# Altium project Smart_Reclyce_Bin.PrjPcb
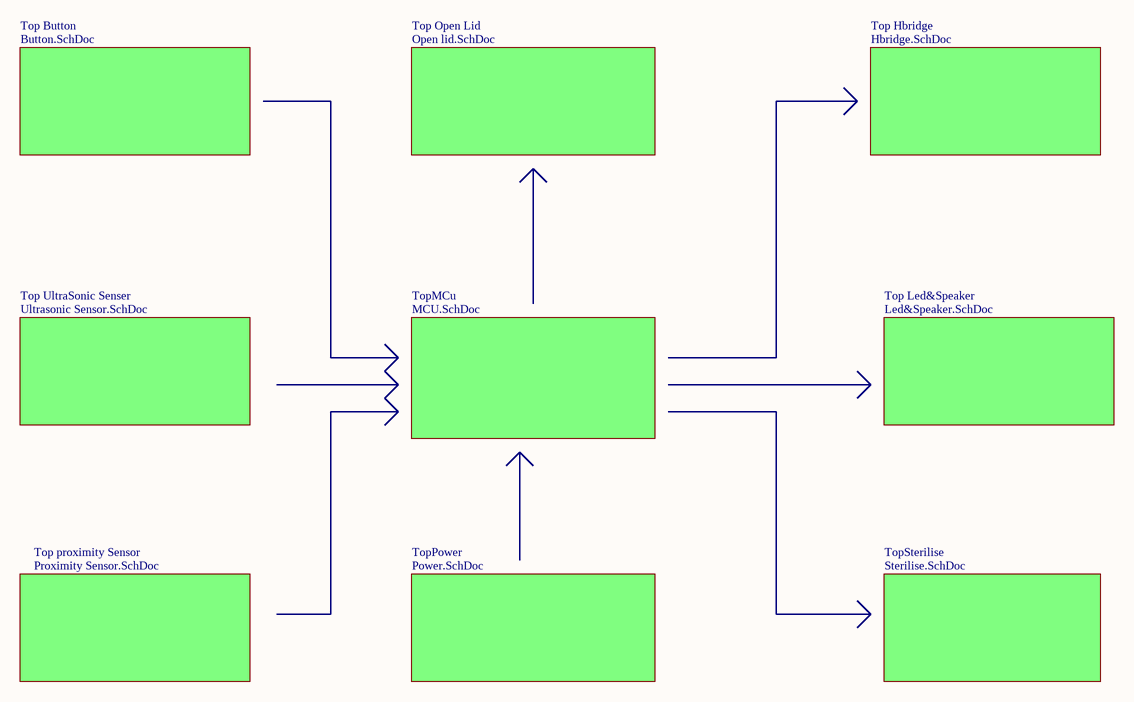
[diagram p0: Smart_Reclyce_Bin.SchDoc]
9 sheets, 233 parts. Net scope: global (net labels, ports and power ports of the same name join across sheets).
Board files: Smart_Reclyce_Bin.PcbDoc, Hbridge.PcbDoc, Open lid.PcbDoc, Proximity Sensor.PcbDoc, Sterilise.PcbDoc, Button.PcbDoc
Sheets:
  Smart_Reclyce_Bin.SchDoc
    TopMCu = MCU.SchDoc
    Top Hbridge = Hbridge.SchDoc
    Top proximity Sensor = Proximity Sensor.SchDoc
    Top Button = Button.SchDoc
    Top Open Lid = Open lid.SchDoc
    Top UltraSonic Senser = Ultrasonic Sensor.SchDoc
    TopSterilise = Sterilise.SchDoc
    Top Led&Speaker = Led&Speaker.SchDoc

## Sheet Smart_Reclyce_Bin.SchDoc
size A4

### Sub-sheets
Top Button = Button.SchDoc: no entries
Top Hbridge = Hbridge.SchDoc: no entries
Top Led&Speaker = Led&Speaker.SchDoc: no entries
Top Open Lid = Open lid.SchDoc: no entries
Top proximity Sensor = Proximity Sensor.SchDoc: no entries
Top UltraSonic Senser = Ultrasonic Sensor.SchDoc: no entries
TopMCu = MCU.SchDoc: no entries
TopPower = Power.SchDoc (file not in this document): no entries
TopSterilise = Sterilise.SchDoc: no entries

## Sheet MCU.SchDoc
size A2
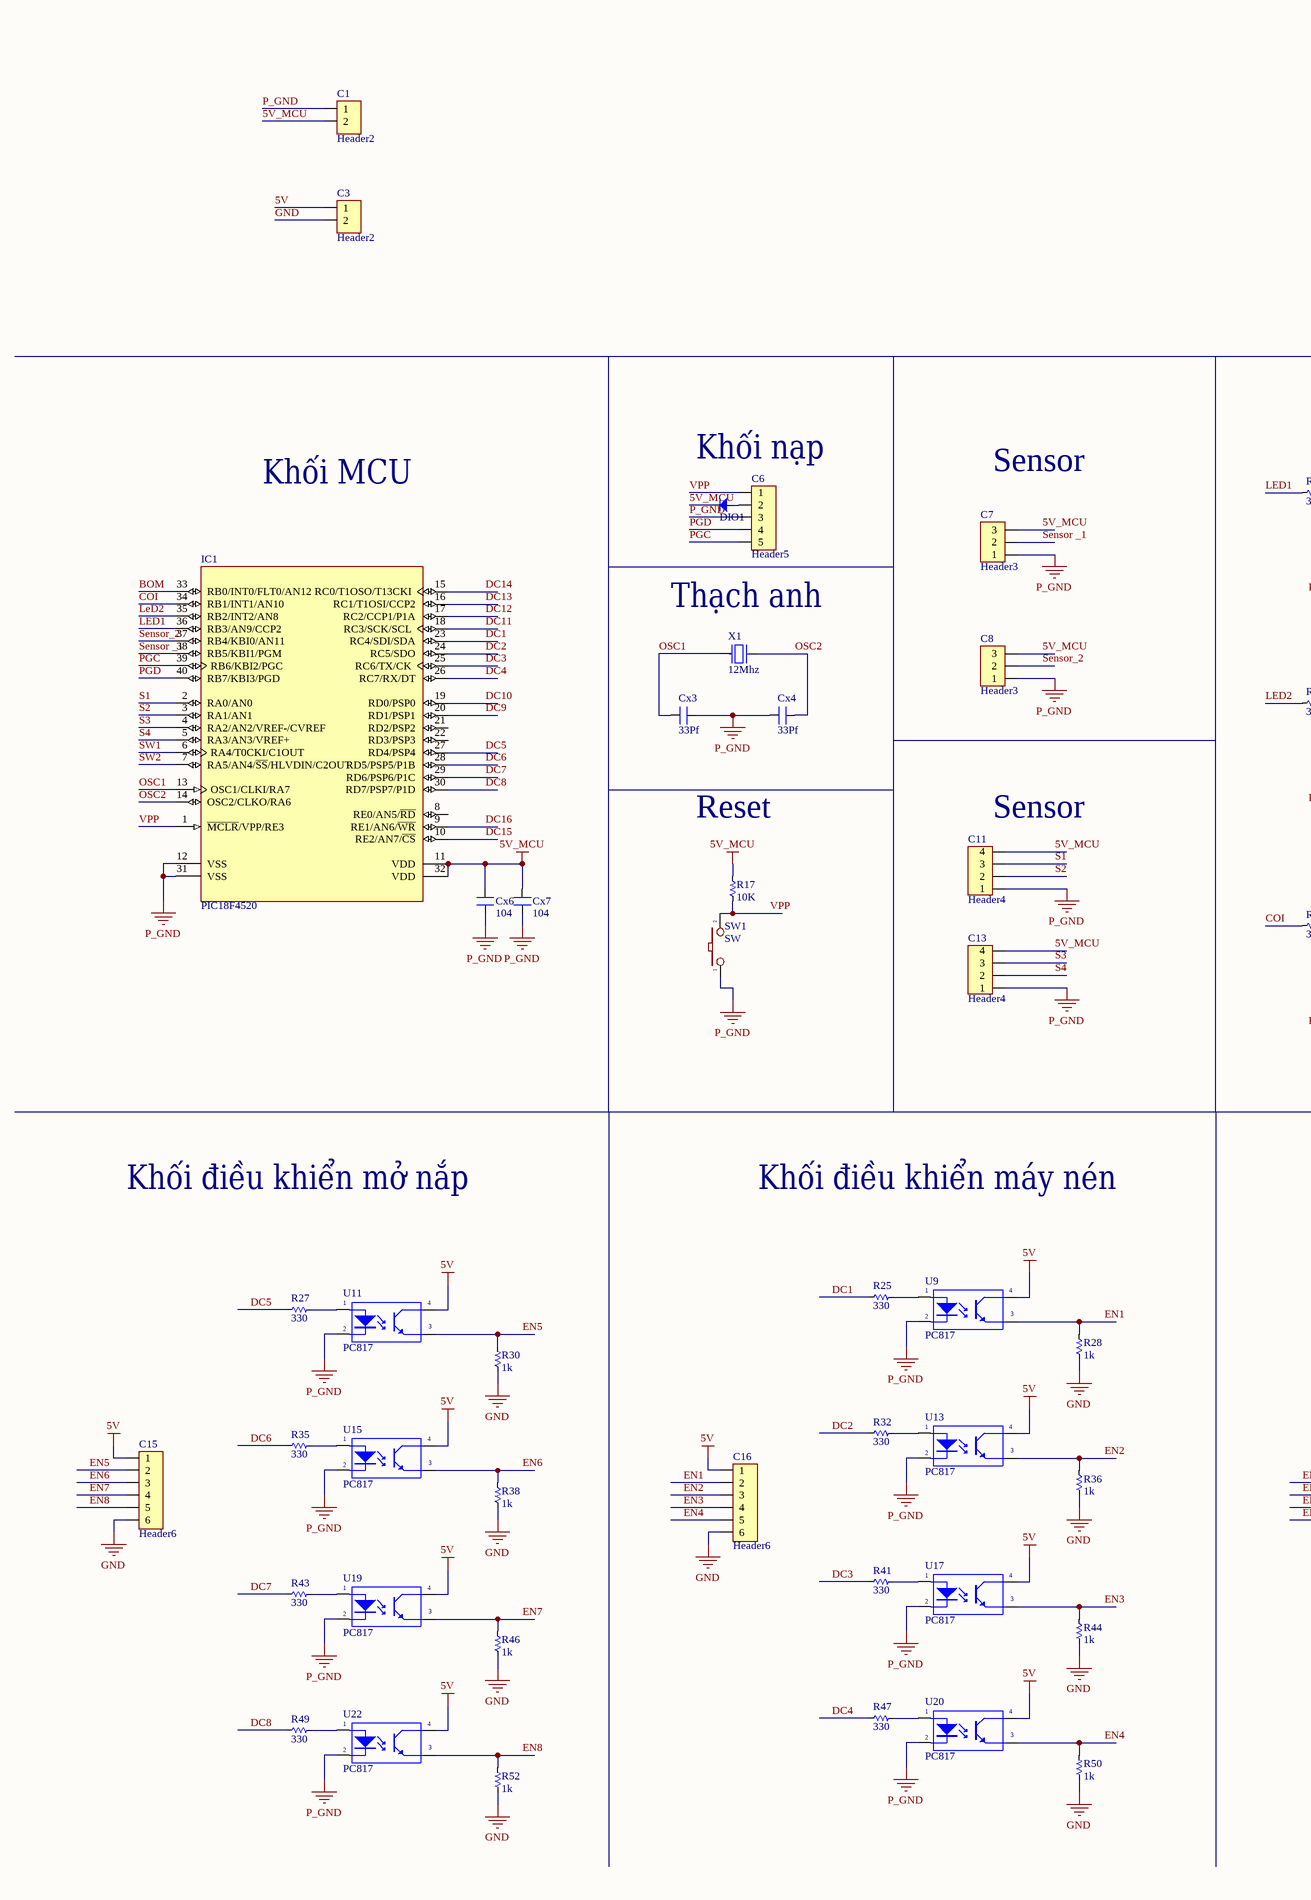
[diagram p1: MCU.SchDoc, left]
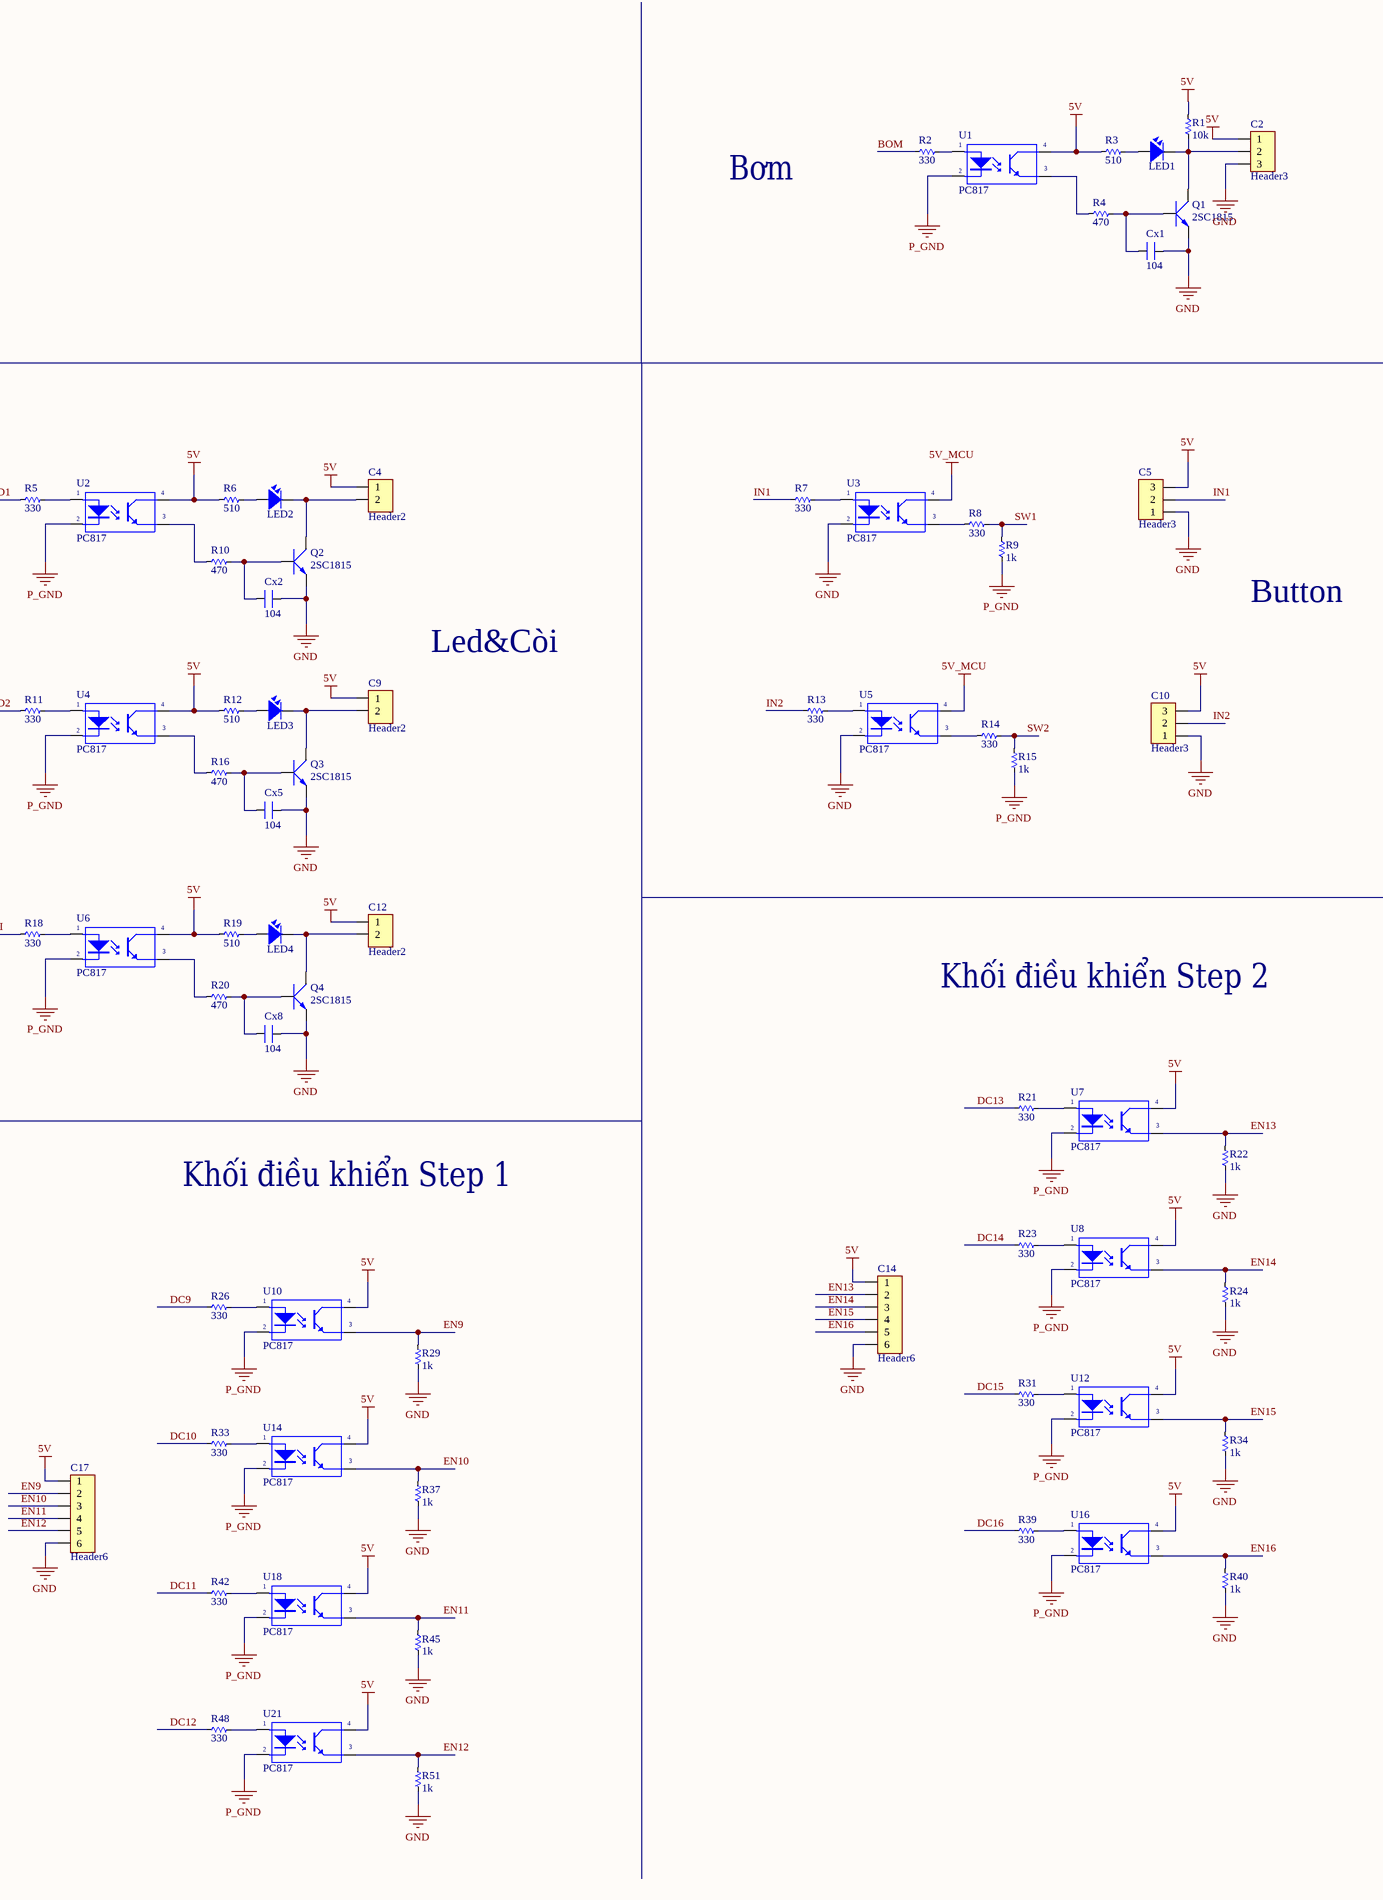
[diagram p2: MCU.SchDoc, right]

### Parts
C1  Header2  [Header2]
C2  Header3  [Header3]
C3  Header2  [Header2]
C4  Header2  [Header2]
C5  Header3  [Header3]
C6  Header5  [HDR5]
C7  Header3  [HDR3]
C8  Header3  [HDR3]
C9  Header2  [Header2]
C10  Header3  [Header3]
C11  Header4  [Header4]
C12  Header2  [Header2]
C13  Header4  [Header4]
C14  Header6  [HDR6]
C15  Header6  [HDR6]
C16  Header6  [HDR6]
C17  Header6  [HDR6]
Cx1  104  [CN-SMD-0805]
Cx2  104  [CN-SMD-0805]
Cx3  33Pf  [CN-SMD-0805]
Cx4  33Pf  [CN-SMD-0805]
Cx5  104  [CN-SMD-0805]
Cx6  104  [CN-SMD-0805]
Cx7  104  [CN-SMD-0805]
Cx8  104  [CN-SMD-0805]
DIO1  Diode SMD  [DIO-SMD-106]  (value not drawn)
IC1  PIC18F4520  [DIP40/W0.6]
LED1  LED  [LED-0805-Red]  (value not drawn)
LED2  LED  [LED-0805-Red]  (value not drawn)
LED3  LED  [LED-0805-Red]  (value not drawn)
LED4  LED  [LED-0805-Red]  (value not drawn)
Q1  2SC1815  [SOT23-321]
Q2  2SC1815  [SOT23-321]
Q3  2SC1815  [SOT23-321]
Q4  2SC1815  [SOT23-321]
R1  10k  [RES-SMD-0805]
R2  330  [RES-SMD-0805]
R3  510  [RES-SMD-0805]
R4  470  [RES-SMD-0805]
R5  330  [RES-SMD-0805]
R6  510  [RES-SMD-0805]
R7  330  [RES-SMD-0805]
R8  330  [RES-SMD-0805]
R9  1k  [RES-SMD-0805]
R10  470  [RES-SMD-0805]
R11  330  [RES-SMD-0805]
R12  510  [RES-SMD-0805]
R13  330  [RES-SMD-0805]
R14  330  [RES-SMD-0805]
R15  1k  [RES-SMD-0805]
R16  470  [RES-SMD-0805]
R17  10K  [RES-SMD-0805]
R18  330  [RES-SMD-0805]
R19  510  [RES-SMD-0805]
R20  470  [RES-SMD-0805]
R21  330  [RES-SMD-0805]
R22  1k  [RES-SMD-0805]
R23  330  [RES-SMD-0805]
R24  1k  [RES-SMD-0805]
R25  330  [RES-SMD-0805]
R26  330  [RES-SMD-0805]
R27  330  [RES-SMD-0805]
R28  1k  [RES-SMD-0805]
R29  1k  [RES-SMD-0805]
R30  1k  [RES-SMD-0805]
R31  330  [RES-SMD-0805]
R32  330  [RES-SMD-0805]
R33  330  [RES-SMD-0805]
R34  1k  [RES-SMD-0805]
R35  330  [RES-SMD-0805]
R36  1k  [RES-SMD-0805]
R37  1k  [RES-SMD-0805]
R38  1k  [RES-SMD-0805]
R39  330  [RES-SMD-0805]
R40  1k  [RES-SMD-0805]
R41  330  [RES-SMD-0805]
R42  330  [RES-SMD-0805]
R43  330  [RES-SMD-0805]
R44  1k  [RES-SMD-0805]
R45  1k  [RES-SMD-0805]
R46  1k  [RES-SMD-0805]
R47  330  [RES-SMD-0805]
R48  330  [RES-SMD-0805]
R49  330  [RES-SMD-0805]
R50  1k  [RES-SMD-0805]
R51  1k  [RES-SMD-0805]
R52  1k  [RES-SMD-0805]
SW1  SW  [SW1-SMD]
U1  PC817  [SO4]
U2  PC817  [SO4]
U3  PC817  [SO4]
U4  PC817  [SO4]
U5  PC817  [SO4]
U6  PC817  [SO4]
U7  PC817  [SO4]
U8  PC817  [SO4]
U9  PC817  [SO4]
U10  PC817  [SO4]
U11  PC817  [SO4]
U12  PC817  [SO4]
U13  PC817  [SO4]
U14  PC817  [SO4]
U15  PC817  [SO4]
U16  PC817  [SO4]
U17  PC817  [SO4]
U18  PC817  [SO4]
U19  PC817  [SO4]
U20  PC817  [SO4]
U21  PC817  [SO4]
U22  PC817  [SO4]
X1  12Mhz  [XTAL-RU49/4]

### Nets
5V: C2.1 C3.1 C4.1 C5.3 C9.1 C10.3 C12.1 C14.1 C15.1 C16.1 C17.1 R1.1 R3.2 R6.2 R12.2 R19.2 U1.4(C) U2.4(C) U4.4(C) U6.4(C) U7.4(C) U8.4(C) U9.4(C) U10.4(C) U11.4(C) U12.4(C) U13.4(C) U14.4(C) U15.4(C) U16.4(C) U17.4(C) U18.4(C) U19.4(C) U20.4(C) U21.4(C) U22.4(C)
5V_MCU: C1.2 C7.3 C8.3 C11.4 C13.4 Cx6.2 Cx7.2 DIO1.2(K) IC1.11(VDD) IC1.32(VDD) R17.1 U3.4(C) U5.4(C)
GND: C2.3 C3.2 C5.1 C10.1 C14.6 C15.6 C16.6 C17.6 Cx1.1 Cx2.1 Cx5.1 Cx8.1 Q1.1(E) Q2.1(E) Q3.1(E) Q4.1(E) R22.2 R24.2 R28.2 R29.2 R30.2 R34.2 R36.2 R37.2 R38.2 R40.2 R44.2 R45.2 R46.2 R50.2 R51.2 R52.2 U3.2(K) U5.2(K)
P_GND: C1.1 C6.3 C7.1 C8.1 C11.1 C13.1 Cx3.2 Cx4.1 Cx6.1 Cx7.1 IC1.12(VSS) IC1.31(VSS) R9.2 R15.2 SW1.1 U1.2(K) U2.2(K) U4.2(K) U6.2(K) U7.2(K) U8.2(K) U9.2(K) U10.2(K) U11.2(K) U12.2(K) U13.2(K) U14.2(K) U15.2(K) U16.2(K) U17.2(K) U18.2(K) U19.2(K) U20.2(K) U21.2(K) U22.2(K)
BOM: IC1.33(RB0/INT0/FLT0/AN12) R2.2
COI: IC1.34(RB1/INT1/AN10) R18.2
DC1: IC1.23(RC4/SDI/SDA) R25.2
DC2: IC1.24(RC5/SDO) R32.2
DC3: IC1.25(RC6/TX/CK) R41.2
DC4: IC1.26(RC7/RX/DT) R47.2
DC5: IC1.27(RD4/PSP4) R27.2
DC6: IC1.28(RD5/PSP5/P1B) R35.2
DC7: IC1.29(RD6/PSP6/P1C) R43.2
DC8: IC1.30(RD7/PSP7/P1D) R49.2
DC9: IC1.20(RD1/PSP1) R26.2
DC10: IC1.19(RD0/PSP0) R33.2
DC11: IC1.18(RC3/SCK/SCL) R42.2
DC12: IC1.17(RC2/CCP1/P1A) R48.2
DC13: IC1.16(RC1/T1OSI/CCP2) R21.2
DC14: IC1.15(RC0/T1OSO/T13CKI) R23.2
DC15: IC1.10(RE2/AN7/~{CS}) R31.2
DC16: IC1.9(RE1/AN6/~{WR}) R39.2
EN1: C16.2 R28.1 U9.3(E)
EN2: C16.3 R36.1 U13.3(E)
EN3: C16.4 R44.1 U17.3(E)
EN4: C16.5 R50.1 U20.3(E)
EN5: C15.2 R30.1 U11.3(E)
EN6: C15.3 R38.1 U15.3(E)
EN7: C15.4 R46.1 U19.3(E)
EN8: C15.5 R52.1 U22.3(E)
EN9: C17.2 R29.1 U10.3(E)
EN10: C17.3 R37.1 U14.3(E)
EN11: C17.4 R45.1 U18.3(E)
EN12: C17.5 R51.1 U21.3(E)
EN13: C14.2 R22.1 U7.3(E)
EN14: C14.3 R24.1 U8.3(E)
EN15: C14.4 R34.1 U12.3(E)
EN16: C14.5 R40.1 U16.3(E)
IN1: C5.2 R7.2
IN2: C10.2 R13.2
LED1: IC1.36(RB3/AN9/CCP2) R5.2
LED2: IC1.35(RB2/INT2/AN8) R11.2
OSC1: Cx3.1 IC1.13(OSC1/CLKI/RA7) X1.1
OSC2: Cx4.2 IC1.14(OSC2/CLKO/RA6) X1.2
PGC: C6.5 IC1.39(RB6/KBI2/PGC)
PGD: C6.4 IC1.40(RB7/KBI3/PGD)
S1: C11.3 IC1.2(RA0/AN0)
S2: C11.2 IC1.3(RA1/AN1)
S3: C13.3 IC1.4(RA2/AN2/VREF-/CVREF)
S4: C13.2 IC1.5(RA3/AN3/VREF+)
Sensor _1: C7.2 IC1.38(RB5/KBI1/PGM)
Sensor_2: C8.2 IC1.37(RB4/KBI0/AN11)
SW1: IC1.6(RA4/T0CKI/C1OUT) R8.1 R9.1
SW2: IC1.7(RA5/AN4/~{SS}/HLVDIN/C2OUT) R14.1 R15.1
VPP: C6.1 IC1.1(~{MCLR}/VPP/RE3) R17.2 SW1.2
NetC2_2: C2.2 LED1.2 Q1.2(C) R1.2
NetC4_2: C4.2 LED2.2 Q2.2(C)
NetC6_2: C6.2 DIO1.1(A)
NetC9_2: C9.2 LED3.2 Q3.2(C)
NetC12_2: C12.2 LED4.2 Q4.2(C)
NetCx1_2: Cx1.2 Q1.3(B) R4.1
NetCx2_2: Cx2.2 Q2.3(B) R10.1
NetCx5_2: Cx5.2 Q3.3(B) R16.1
NetCx8_2: Cx8.2 Q4.3(B) R20.1
NetLED1_1: LED1.1 R3.1
NetLED2_1: LED2.1 R6.1
NetLED3_1: LED3.1 R12.1
NetLED4_1: LED4.1 R19.1
NetR2_1: R2.1 U1.1(A)
NetR4_2: R4.2 U1.3(E)
NetR5_1: R5.1 U2.1(A)
NetR7_1: R7.1 U3.1(A)
NetR8_2: R8.2 U3.3(E)
NetR10_2: R10.2 U2.3(E)
NetR11_1: R11.1 U4.1(A)
NetR13_1: R13.1 U5.1(A)
NetR14_2: R14.2 U5.3(E)
NetR16_2: R16.2 U4.3(E)
NetR18_1: R18.1 U6.1(A)
NetR20_2: R20.2 U6.3(E)
NetR21_1: R21.1 U7.1(A)
NetR23_1: R23.1 U8.1(A)
NetR25_1: R25.1 U9.1(A)
NetR26_1: R26.1 U10.1(A)
NetR27_1: R27.1 U11.1(A)
NetR31_1: R31.1 U12.1(A)
NetR32_1: R32.1 U13.1(A)
NetR33_1: R33.1 U14.1(A)
NetR35_1: R35.1 U15.1(A)
NetR39_1: R39.1 U16.1(A)
NetR41_1: R41.1 U17.1(A)
NetR42_1: R42.1 U18.1(A)
NetR43_1: R43.1 U19.1(A)
NetR47_1: R47.1 U20.1(A)
NetR48_1: R48.1 U21.1(A)
NetR49_1: R49.1 U22.1(A)

Not connected (* = marked no-connect by the designer): IC1 8(RE0/AN5/~{RD}) 21(RD2/PSP2) 22(RD3/PSP3)

### Notes on the sheet
- Bơm
- Khối MCU
- Khối nạp
- Sensor
- Thạch anh
- Button
- Led&Còi
- Reset
- (near C11) Sensor
- Khối điều khiển Step 2
- Khối điều khiển Step 1
- Khối điều khiển mở nắp
- Khối điều khiển máy nén

### Library data of the parts
C1 C3 C4 C9 C12 = Header2: Header IDC, 2 x 1 Pin Vertical 2.54mm Pitch (Non-Boxed, Male); Manufacturer: W¨¹rth Elektronik eiSos GmbH; partNo: 613002143121; ComponentLink1 Description: Manufacturer; ComponentLink2 Description: Datasheet; NoPins: 02; Created Date: 29 March 2013; ComponentLink1URL: http://www.we-online.com; ComponentLink2URL: http://katalog.we-online.de/em/datasheet/6130xx143121.pdf; Created by: Karrer Zheng
C2 C5 C7 C8 C10 = Header3: Header IDC, 3 x 1 Pin Vertical 2.54mm Pitch (Non-Boxed, Male); Manufacturer: W¨¹rth Elektronik eiSos GmbH; partNo: 613002143121; ComponentLink1 Description: Manufacturer; ComponentLink2 Description: Datasheet; NoPins: 02; Created Date: 29 March 2013; ComponentLink1URL: http://www.we-online.com; ComponentLink2URL: http://katalog.we-online.de/em/datasheet/6130xx143121.pdf; Created by: Karrer Zheng
C6 = Header5: Header IDC, 5 x 1 Pin Vertical 2.54mm Pitch (Non-Boxed, Male); Manufacturer: W¨¹rth Elektronik eiSos GmbH; partNo: 613002143121; ComponentLink1 Description: Manufacturer; ComponentLink2 Description: Datasheet; NoPins: 02; Created Date: 29 March 2013; ComponentLink1URL: http://www.we-online.com; ComponentLink2URL: http://katalog.we-online.de/em/datasheet/6130xx143121.pdf; Created by: Karrer Zheng
C11 C13 = Header4: Header IDC, 4 x 1 Pin Vertical 2.54mm Pitch (Non-Boxed, Male); Manufacturer: W¨¹rth Elektronik eiSos GmbH; partNo: 613002143121; ComponentLink1 Description: Manufacturer; ComponentLink2 Description: Datasheet; NoPins: 02; Created Date: 29 March 2013; ComponentLink1URL: http://www.we-online.com; ComponentLink2URL: http://katalog.we-online.de/em/datasheet/6130xx143121.pdf; Created by: Karrer Zheng
C14-C17 = Header6: Header IDC, 6 x 1 Pin Vertical 2.54mm Pitch (Non-Boxed, Male); Manufacturer: W¨¹rth Elektronik eiSos GmbH; partNo: 613002143121; ComponentLink1 Description: Manufacturer; ComponentLink2 Description: Datasheet; NoPins: 02; Created Date: 29 March 2013; ComponentLink1URL: http://www.we-online.com; ComponentLink2URL: http://katalog.we-online.de/em/datasheet/6130xx143121.pdf; Created by: Karrer Zheng
Cx1 Cx2 Cx5-Cx8 = CN: Value: 33pF
Cx3 Cx4 = CN: Value: 33pF
DIO1 = Diode SMD: Default Diode; Code - JEDEC: DO-214-AB; Value: 1N5007; Published: 8-Jun-2000; Revision: July-2002: Re-released for DXP Platform.; Publisher: Altium Limited
IC1 = PIC18F4520: 32KB Flash, 1536B RAM, 256B EFROM, 40-Pin PDIP; Value: DIP 40; Value: 18F4520; Copyright by: VanDungEvn
LED1-LED4 = LED SMD: Value: LED 3 - 5 ly 2 Colour
Q1-Q4 = 2SC1815: NPN 600mW, ECB; Value: C1815
R1-R52 = Res-SMD: Resistor; Manufacturer: Generic Components; Class: Passive; Published: 08/06/2000; Publisher: Altium Hobart Technology Centre
SW1 = SW2: Switch button 2 pin; Value: SW chip 2 pin
U1-U22 = PC817: Single Opto; Value: PC817
X1 = XT2: Crystal, 32.768 KHz, -40 to 85 degC, 3.2 x 1.5 x 0.9 mm SMD; Value: 4Mhz

## Sheet Hbridge.SchDoc
size A
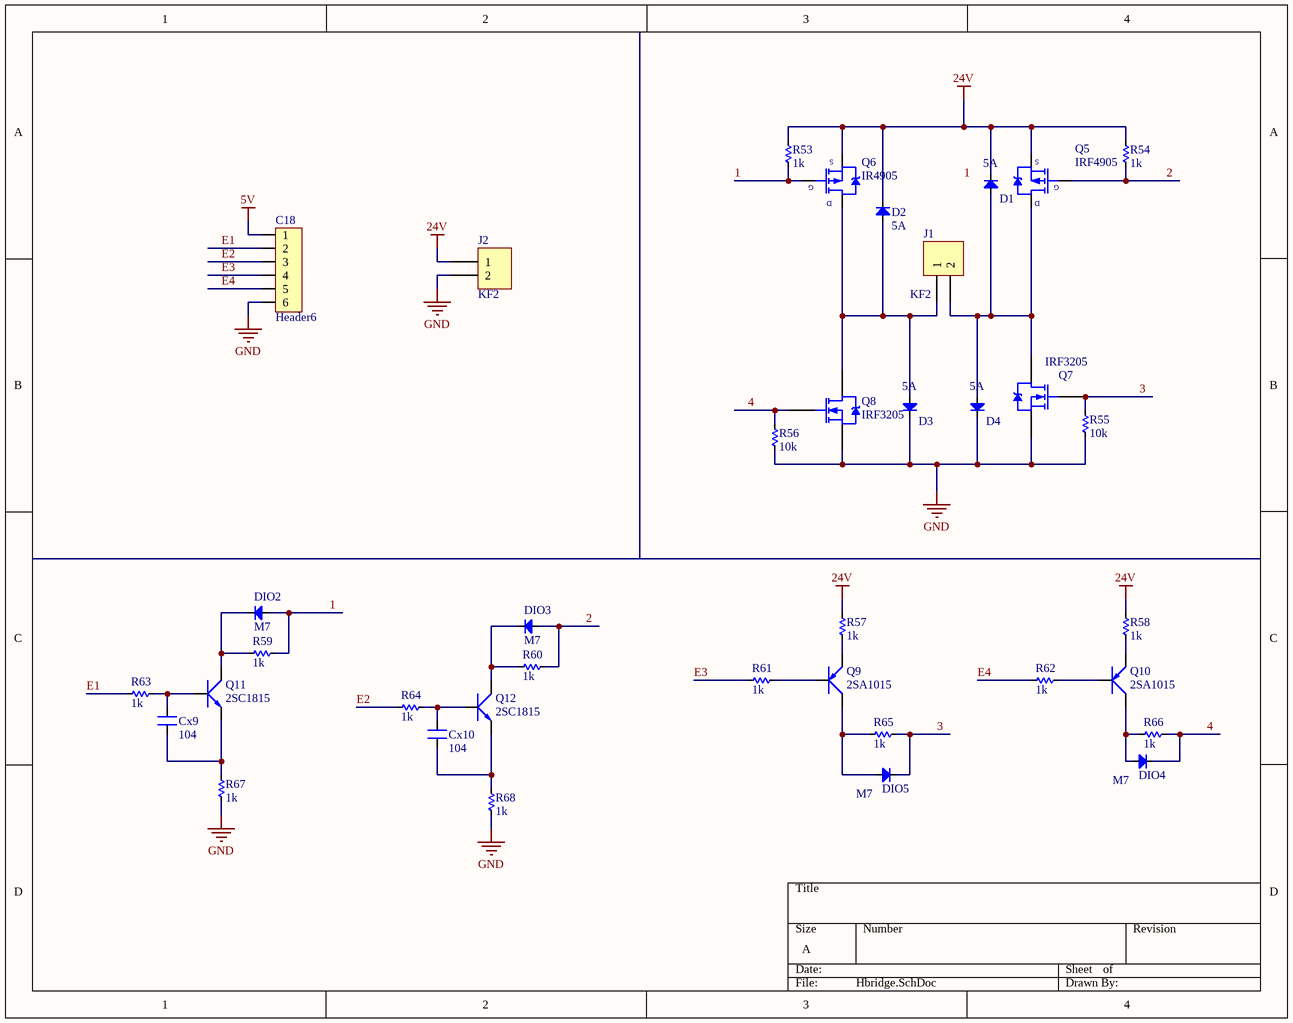
[diagram p3: Hbridge.SchDoc]

### Parts
C18  Header6  [HDR6]
Cx9  104  [CN-SMD-0805]
Cx10  104  [CN-SMD-0805]
D1  5A  [DIO-5A]
D2  5A  [DIO-5A]
D3  5A  [DIO-5A]
D4  5A  [DIO-5A]
DIO2  M7  [DIO-SMD-106]
DIO3  M7  [DIO-SMD-106]
DIO4  M7  [DIO-SMD-106]
DIO5  M7  [DIO-SMD-106]
J1  KF2  [KF2-7.62]
J2  KF2  [KF2-7.62]
Q5  IRF4905  [TO220-123]
Q6  IR4905  [TO220-123]
Q7  IRF3205  [TO220-123]
Q8  IRF3205  [TO220-123]
Q9  2SA1015  [SOT23-321]
Q10  2SA1015  [SOT23-321]
Q11  2SC1815  [SOT23-321]
Q12  2SC1815  [SOT23-321]
R53  1k  [RES-1/4W-SMALL]
R54  1k  [RES-1/4W-SMALL]
R55  10k  [RES-1/4W-SMALL]
R56  10k  [RES-1/4W-SMALL]
R57  1k  [RES-SMD-0805]
R58  1k  [RES-SMD-0805]
R59  1k  [RES-SMD-0805]
R60  1k  [RES-SMD-0805]
R61  1k  [RES-SMD-0805]
R62  1k  [RES-SMD-0805]
R63  1k  [RES-SMD-0805]
R64  1k  [RES-SMD-0805]
R65  1k  [RES-SMD-0805]
R66  1k  [RES-SMD-0805]
R67  1k  [RES-SMD-0805]
R68  1k  [RES-SMD-0805]

### Nets
5V: C18.1
24V: D1.2(K) D2.2(K) J2.1 Q5.3(S) Q6.3(S) R53.1 R54.1 R57.1 R58.1
GND: C18.6 D3.2(K) D4.2(K) J2.2 Q7.3(S) Q8.3(S) R55.2 R56.2 R67.2 R68.2
1: DIO2.1(A) Q6.1(G) R53.2 R59.1
2: DIO3.1(A) Q5.1(G) R54.2 R60.1
3: DIO5.2(K) Q7.1(G) R55.1 R65.1
4: DIO4.2(K) Q8.1(G) R56.1 R66.1
E1: C18.2 R63.2
E2: C18.3 R64.2
E3: C18.4 R61.2
E4: C18.5 R62.2
NetCx9_1: Cx9.1 Q11.1(E) R67.1
NetCx9_2: Cx9.2 Q11.3(B) R63.1
NetCx10_1: Cx10.1 Q12.1(E) R68.1
NetCx10_2: Cx10.2 Q12.3(B) R64.1
NetD1_1: D1.1(A) D4.1(A) J1.2 Q5.2(D) Q7.2(D)
NetD2_1: D2.1(A) D3.1(A) J1.1 Q6.2(D) Q8.2(D)
NetDIO2_2: DIO2.2(K) Q11.2(C) R59.2
NetDIO3_2: DIO3.2(K) Q12.2(C) R60.2
NetDIO4_1: DIO4.1(A) Q10.2(C) R66.2
NetDIO5_1: DIO5.1(A) Q9.2(C) R65.2
NetQ9_1: Q9.1(E) R57.2
NetQ9_3: Q9.3(B) R61.1
NetQ10_1: Q10.1(E) R58.2
NetQ10_3: Q10.3(B) R62.1

### Notes on the sheet
- Labels drawn without touching a wire or pin: 1

### Library data of the parts
C18 = Header6: as C14 on sheet MCU; Created Date: 29 March 2013; ComponentLink1URL: http://www.we-online.com; ComponentLink2URL: http://katalog.we-online.de/em/datasheet/6130xx143121.pdf; Created by: Karrer Zheng
Cx9 Cx10 = CN: Value: 33pF
D1-D4 = Diode: Default Diode TMS; Code - JEDEC: DO-214-AB; Value: 1N5007; Published: 8-Jun-2000; Revision: July-2002: Re-released for DXP Platform.; Publisher: Altium Limited
DIO2-DIO5 = Diode SMD: as DIO1 on sheet MCU; Published: 8-Jun-2000; Revision: July-2002: Re-released for DXP Platform.; Publisher: Altium Limited
J1 J2 = KF2: Manufacturer: Würth Elektronik eiSos GmbH; partNo: 691103110002; ComponentLink1 Description: Manufacturer; ComponentLink2 Description: Datasheet; NoPins: 2; Created Date: 29 October 2013; ComponentLink1URL: http://www.we-online.com; ComponentLink2URL: http://katalog.we-online.de/em/datasheet/6911031100xx.pdf; Created by: Karrer Zheng
Q5 Q6 = IRF9540: HEXFET P-Channel Power MOSFET; Value: IRF840
Q7 Q8 = IRFZ44: Value: IRF840
Q9 Q10 = 2SA1015: PNP 600mW, ECB; Value: A1015
Q11 Q12 = 2SC1815: NPN 600mW, ECB; Value: C1815
R53-R56 = Res: Manufacturer: Generic Components; Class: Passive; SubClass: R; Published: 08/06/2000; Publisher: Altium Hobart Technology Centre
R57-R68 = Res-SMD: as R1 on sheet MCU; Published: 08/06/2000; Publisher: Altium Hobart Technology Centre

## Sheet Proximity Sensor.SchDoc
size A
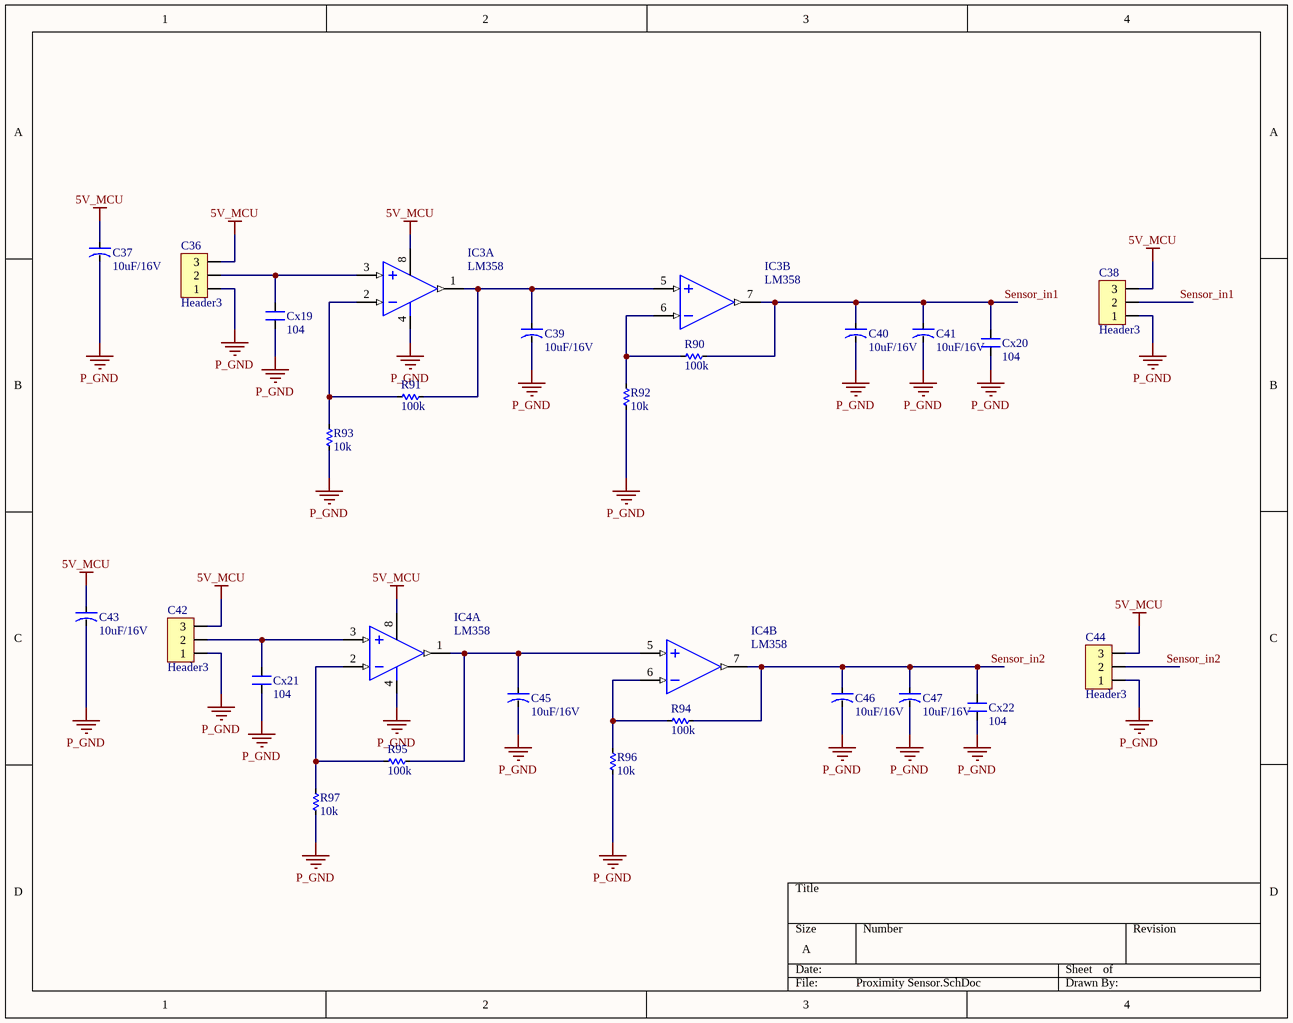
[diagram p4: Proximity Sensor.SchDoc]

### Parts
C36  Header3  [Header3]
C37  10uF/16V  [TANTALUM-3216]
C38  Header3  [Header3]
C39  10uF/16V  [TANTALUM-3216]
C40  10uF/16V  [TANTALUM-3216]
C41  10uF/16V  [TANTALUM-3216]
C42  Header3  [Header3]
C43  10uF/16V  [TANTALUM-3216]
C44  Header3  [Header3]
C45  10uF/16V  [TANTALUM-3216]
C46  10uF/16V  [TANTALUM-3216]
C47  10uF/16V  [TANTALUM-3216]
Cx19  104  [CN-SMD-0805]
Cx20  104  [CN-SMD-0805]
Cx21  104  [CN-SMD-0805]
Cx22  104  [CN-SMD-0805]
IC3  LM358  [SO8]  (parts A,B of 2)
IC4  LM358  [SO8]  (parts A,B of 2)
R90  100k  [RES-SMD-0805]
R91  100k  [RES-SMD-0805]
R92  10k  [RES-SMD-0805]
R93  10k  [RES-SMD-0805]
R94  100k  [RES-SMD-0805]
R95  100k  [RES-SMD-0805]
R96  10k  [RES-SMD-0805]
R97  10k  [RES-SMD-0805]

### Nets
5V_MCU: C36.3 C37.1 C38.3 C42.3 C43.1 C44.3 IC3.8(+V) IC4.8(+V)
P_GND: C36.1 C37.2 C38.1 C39.2 C40.2 C41.2 C42.1 C43.2 C44.1 C45.2 C46.2 C47.2 Cx19.1 Cx20.1 Cx21.1 Cx22.1 IC3.4(-V) IC4.4(-V) R92.2 R93.2 R96.2 R97.2
Sensor_in1: C38.2 C40.1 C41.1 Cx20.2 IC3.7(OUT) R90.1
Sensor_in2: C44.2 C46.1 C47.1 Cx22.2 IC4.7(OUT) R94.1
NetC36_2: C36.2 Cx19.2 IC3.3(IN+)
NetC39_1: C39.1 IC3.1(OUT) IC3.5(IN+) R91.1
NetC42_2: C42.2 Cx21.2 IC4.3(IN+)
NetC45_1: C45.1 IC4.1(OUT) IC4.5(IN+) R95.1
NetIC3_2: IC3.2(IN-) R91.2 R93.1
NetIC3_6: IC3.6(IN-) R90.2 R92.1
NetIC4_2: IC4.2(IN-) R95.2 R97.1
NetIC4_6: IC4.6(IN-) R94.2 R96.1

### Library data of the parts
C36 C38 C42 C44 = Header3: as C2 on sheet MCU; Created Date: 29 March 2013; ComponentLink1URL: http://www.we-online.com; ComponentLink2URL: http://katalog.we-online.de/em/datasheet/6130xx143121.pdf; Created by: Karrer Zheng
C37 C39-C41 C43 C45-C47 = CN-TANTALUM-SMD
Cx19-Cx22 = CN: Value: 33pF
IC3 IC4 = LM358: Low-Power Dual Operational Amplifier; Value: LM358
R90-R97 = Res-SMD: as R1 on sheet MCU; Published: 08/06/2000; Publisher: Altium Hobart Technology Centre

## Sheet Button.SchDoc
size A
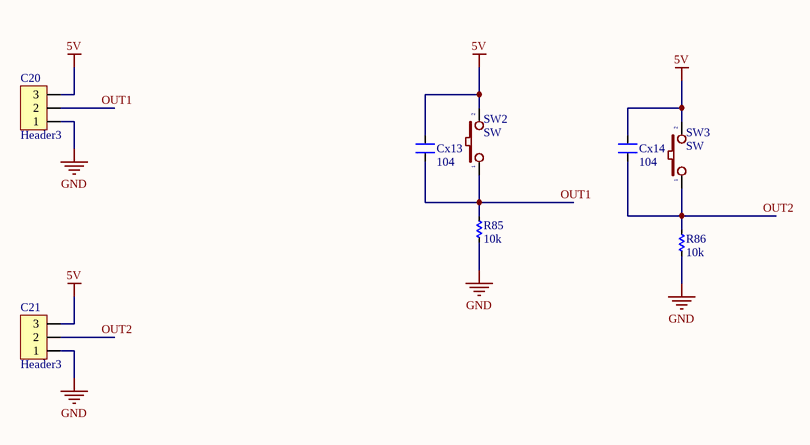
[diagram p5: Button.SchDoc]

### Parts
C20  Header3  [Header3]
C21  Header3  [Header3]
Cx13  104  [CN-SMD-0805]
Cx14  104  [CN-SMD-0805]
R85  10k  [RES-SMD-0805]
R86  10k  [RES-SMD-0805]
SW2  SW  [SW1-SMD]
SW3  SW  [SW1-SMD]

### Nets
5V: C20.3 C21.3 Cx13.2 Cx14.2 SW2.2 SW3.2
GND: C20.1 C21.1 R85.2 R86.2
OUT1: C20.2 Cx13.1 R85.1 SW2.1
OUT2: C21.2 Cx14.1 R86.1 SW3.1

### Library data of the parts
C20 C21 = Header3: as C2 on sheet MCU; Created Date: 29 March 2013; ComponentLink1URL: http://www.we-online.com; ComponentLink2URL: http://katalog.we-online.de/em/datasheet/6130xx143121.pdf; Created by: Karrer Zheng
Cx13 Cx14 = CN: Value: 33pF
R85 R86 = Res-SMD: as R1 on sheet MCU; Published: 08/06/2000; Publisher: Altium Hobart Technology Centre
SW2 SW3 = SW2: as SW1 on sheet MCU

## Sheet Open lid.SchDoc
size A
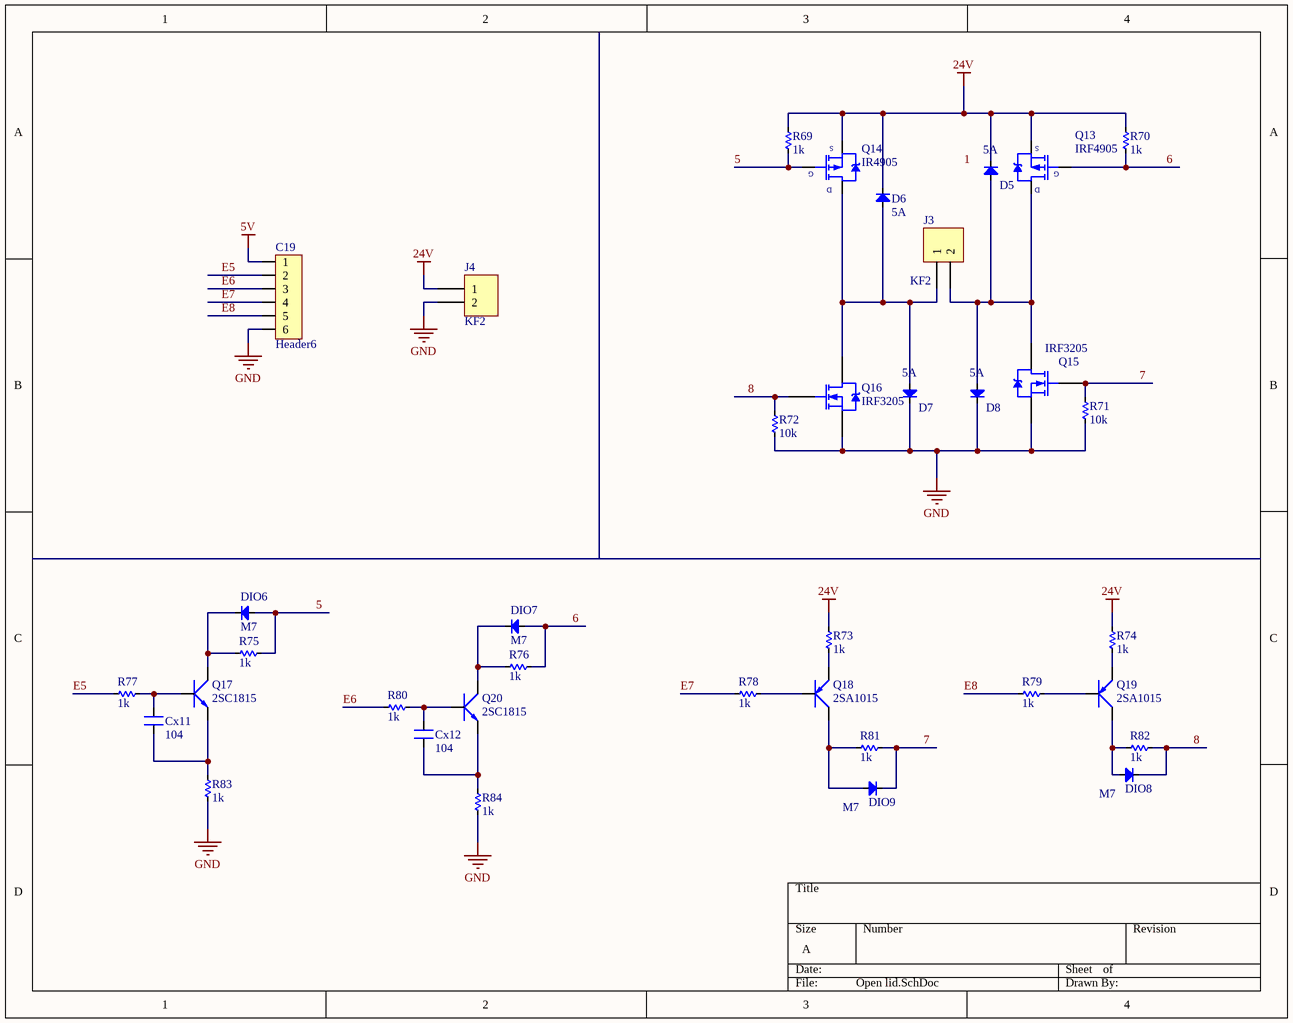
[diagram p6: Open lid.SchDoc]

### Parts
C19  Header6  [HDR6]
Cx11  104  [CN-SMD-0805]
Cx12  104  [CN-SMD-0805]
D5  5A  [DIO-5A]
D6  5A  [DIO-5A]
D7  5A  [DIO-5A]
D8  5A  [DIO-5A]
DIO6  M7  [DIO-SMD-106]
DIO7  M7  [DIO-SMD-106]
DIO8  M7  [DIO-SMD-106]
DIO9  M7  [DIO-SMD-106]
J3  KF2  [KF2-7.62]
J4  KF2  [KF2-7.62]
Q13  IRF4905  [TO220-123]
Q14  IR4905  [TO220-123]
Q15  IRF3205  [TO220-123]
Q16  IRF3205  [TO220-123]
Q17  2SC1815  [SOT23-321]
Q18  2SA1015  [SOT23-321]
Q19  2SA1015  [SOT23-321]
Q20  2SC1815  [SOT23-321]
R69  1k  [RES-1/4W-SMALL]
R70  1k  [RES-1/4W-SMALL]
R71  10k  [RES-1/4W-SMALL]
R72  10k  [RES-1/4W-SMALL]
R73  1k  [RES-SMD-0805]
R74  1k  [RES-SMD-0805]
R75  1k  [RES-SMD-0805]
R76  1k  [RES-SMD-0805]
R77  1k  [RES-SMD-0805]
R78  1k  [RES-SMD-0805]
R79  1k  [RES-SMD-0805]
R80  1k  [RES-SMD-0805]
R81  1k  [RES-SMD-0805]
R82  1k  [RES-SMD-0805]
R83  1k  [RES-SMD-0805]
R84  1k  [RES-SMD-0805]

### Nets
5V: C19.1
24V: D5.2(K) D6.2(K) J4.1 Q13.3(S) Q14.3(S) R69.1 R70.1 R73.1 R74.1
GND: C19.6 D7.2(K) D8.2(K) J4.2 Q15.3(S) Q16.3(S) R71.2 R72.2 R83.2 R84.2
5: DIO6.1(A) Q14.1(G) R69.2 R75.1
6: DIO7.1(A) Q13.1(G) R70.2 R76.1
7: DIO9.2(K) Q15.1(G) R71.1 R81.1
8: DIO8.2(K) Q16.1(G) R72.1 R82.1
E5: C19.2 R77.2
E6: C19.3 R80.2
E7: C19.4 R78.2
E8: C19.5 R79.2
NetCx11_1: Cx11.1 Q17.1(E) R83.1
NetCx11_2: Cx11.2 Q17.3(B) R77.1
NetCx12_1: Cx12.1 Q20.1(E) R84.1
NetCx12_2: Cx12.2 Q20.3(B) R80.1
NetD5_1: D5.1(A) D8.1(A) J3.2 Q13.2(D) Q15.2(D)
NetD6_1: D6.1(A) D7.1(A) J3.1 Q14.2(D) Q16.2(D)
NetDIO6_2: DIO6.2(K) Q17.2(C) R75.2
NetDIO7_2: DIO7.2(K) Q20.2(C) R76.2
NetDIO8_1: DIO8.1(A) Q19.2(C) R82.2
NetDIO9_1: DIO9.1(A) Q18.2(C) R81.2
NetQ18_1: Q18.1(E) R73.2
NetQ18_3: Q18.3(B) R78.1
NetQ19_1: Q19.1(E) R74.2
NetQ19_3: Q19.3(B) R79.1

### Notes on the sheet
- Labels drawn without touching a wire or pin: 1

### Library data of the parts
C19 = Header6: as C14 on sheet MCU; Created Date: 29 March 2013; ComponentLink1URL: http://www.we-online.com; ComponentLink2URL: http://katalog.we-online.de/em/datasheet/6130xx143121.pdf; Created by: Karrer Zheng
Cx11 Cx12 = CN: Value: 33pF
D5-D8 = Diode: Default Diode; Code - JEDEC: DO-214-AB; Value: 1N5007; Published: 8-Jun-2000; Revision: July-2002: Re-released for DXP Platform.; Publisher: Altium Limited
DIO6-DIO9 = Diode SMD: as DIO1 on sheet MCU; Published: 8-Jun-2000; Revision: July-2002: Re-released for DXP Platform.; Publisher: Altium Limited
J3 J4 = KF2: as J1 on sheet Hbridge; Created Date: 29 October 2013; ComponentLink1URL: http://www.we-online.com; ComponentLink2URL: http://katalog.we-online.de/em/datasheet/6911031100xx.pdf; Created by: Karrer Zheng
Q13 Q14 = IRF9540: as Q5 on sheet Hbridge
Q15 Q16 = IRFZ44: Value: IRF840
Q17 Q20 = 2SC1815: NPN 600mW, ECB; Value: C1815
Q18 Q19 = 2SA1015: PNP 600mW, ECB; Value: A1015
R69-R72 = Res: as R53 on sheet Hbridge; Published: 08/06/2000; Publisher: Altium Hobart Technology Centre
R73-R84 = Res-SMD: as R1 on sheet MCU; Published: 08/06/2000; Publisher: Altium Hobart Technology Centre

## Sheet Ultrasonic Sensor.SchDoc
size A
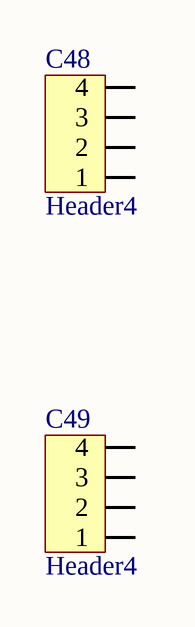
[diagram p7: Ultrasonic Sensor.SchDoc]

### Parts
C48  Header4  [HDR4]
C49  Header4  [HDR4]

### Nets

Not connected (* = marked no-connect by the designer): C48 1 2 3 4; C49 1 2 3 4

### Library data of the parts
C48 C49 = Header4: as C11 on sheet MCU; Created Date: 29 March 2013; ComponentLink1URL: http://www.we-online.com; ComponentLink2URL: http://katalog.we-online.de/em/datasheet/6130xx143121.pdf; Created by: Karrer Zheng

## Sheet Sterilise.SchDoc
size A
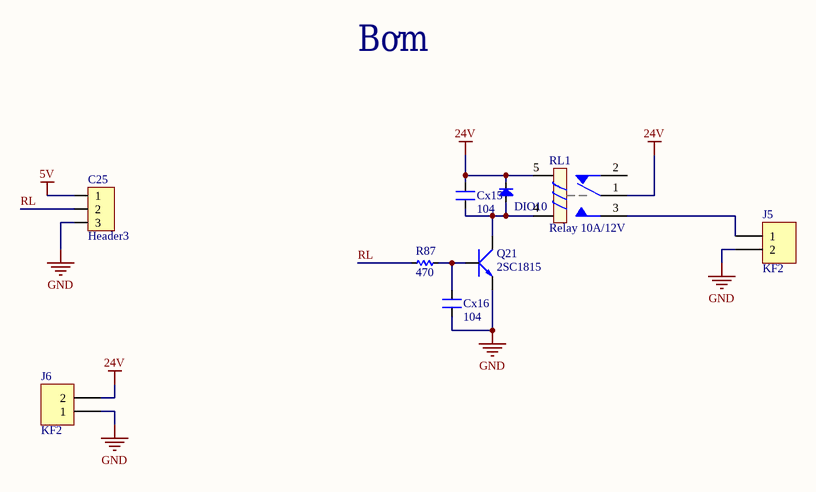
[diagram p8: Sterilise.SchDoc]

### Parts
C25  Header3  [Header3]
Cx15  104  [CN-SMD-0805]
Cx16  104  [CN-SMD-0805]
DIO10  Diode SMD  [DIO-SMD-106]  (value not drawn)
J5  KF2  [KF2-7.62]
J6  KF2  [KF2-7.62]
Q21  2SC1815  [SOT23-321]
R87  470  [RES-SMD-0805]
RL1  Relay 10A/12V  [RELAY 5]

### Nets
5V: C25.1
24V: Cx15.2 DIO10.2(K) J6.2 RL1.1 RL1.5
GND: C25.3 Cx16.1 J5.2 J6.1 Q21.1(E)
RL: C25.2 R87.2
NetCx15_1: Cx15.1 DIO10.1(A) Q21.2(C) RL1.4
NetCx16_2: Cx16.2 Q21.3(B) R87.1
NetJ5_1: J5.1 RL1.3

Not connected (* = marked no-connect by the designer): RL1 2

### Notes on the sheet
- Bơm

### Library data of the parts
C25 = Header3: as C2 on sheet MCU; Created Date: 29 March 2013; ComponentLink1URL: http://www.we-online.com; ComponentLink2URL: http://katalog.we-online.de/em/datasheet/6130xx143121.pdf; Created by: Karrer Zheng
Cx15 Cx16 = CN: Value: 33pF
DIO10 = Diode SMD: as DIO1 on sheet MCU; Published: 8-Jun-2000; Revision: July-2002: Re-released for DXP Platform.; Publisher: Altium Limited
J5 J6 = KF2: as J1 on sheet Hbridge; Created Date: 29 October 2013; ComponentLink1URL: http://www.we-online.com; ComponentLink2URL: http://katalog.we-online.de/em/datasheet/6911031100xx.pdf; Created by: Karrer Zheng
Q21 = 2SC1815: NPN 600mW, ECB; Value: C1815
R87 = Res-SMD: as R1 on sheet MCU; Published: 08/06/2000; Publisher: Altium Hobart Technology Centre
RL1 = Relay 5: Relay SPDT,10A - 12VDC 5 Pin; Value: Relay SPDT, 10A, 12V

## Sheet Led&Speaker.SchDoc
size A
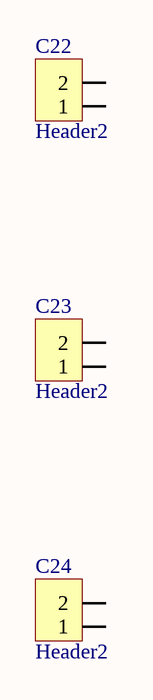
[diagram p9: Led&Speaker.SchDoc]

### Parts
C22  Header2  [Header2]
C23  Header2  [Header2]
C24  Header2  [Header2]

### Nets

Not connected (* = marked no-connect by the designer): C22 1 2; C23 1 2; C24 1 2

### Library data of the parts
C22-C24 = Header2: as C1 on sheet MCU; Created Date: 29 March 2013; ComponentLink1URL: http://www.we-online.com; ComponentLink2URL: http://katalog.we-online.de/em/datasheet/6130xx143121.pdf; Created by: Karrer Zheng

## Nets that join several sheets
5V: MCU (36 pins), Hbridge (C18.1), Button (6 pins), Open lid (C19.1), Sterilise (C25.1)
5V_MCU: MCU (13 pins), Proximity Sensor (8 pins)
24V: Hbridge (9 pins), Open lid (9 pins), Sterilise (5 pins)
GND: MCU (34 pins), Hbridge (10 pins), Button (C20.1 C21.1 R85.2 R86.2), Open lid (10 pins), Sterilise (5 pins)
P_GND: MCU (35 pins), Proximity Sensor (22 pins)